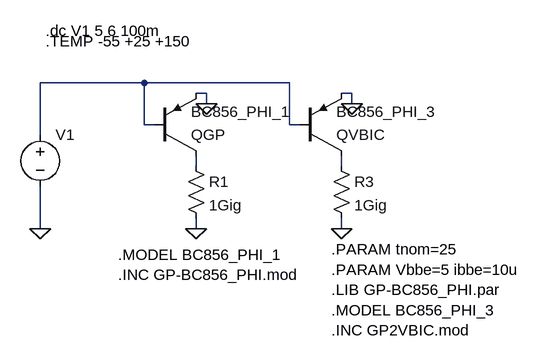
[diagram p0: schematic Level9Comparison.asc]
Level9Comparison.asc, the LTspice schematic file:
Version 4
SHEET 1 5756 2000
WIRE 1840 704 1680 704
WIRE 2064 704 1840 704
WIRE 1936 720 1920 720
WIRE 2160 720 2144 720
WIRE 1936 736 1936 720
WIRE 2160 736 2160 720
WIRE 1840 768 1840 704
WIRE 1856 768 1840 768
WIRE 2064 768 2064 704
WIRE 2080 768 2064 768
WIRE 1680 784 1680 704
WIRE 1920 832 1920 816
WIRE 2144 832 2144 816
WIRE 1680 928 1680 864
WIRE 1920 928 1920 912
WIRE 2144 928 2144 912
FLAG 1936 736 0
FLAG 1680 928 0
FLAG 1920 928 0
FLAG 2160 736 0
FLAG 2144 928 0
SYMBOL voltage 1680 768 R0
WINDOW 3 24 104 Invisible 0
WINDOW 123 0 0 Left 0
WINDOW 39 0 0 Left 0
SYMATTR Value 1
SYMATTR InstName V1
SYMBOL pnp 1856 816 M180
SYMATTR InstName QGP
SYMATTR Value BC856_PHI_1
SYMBOL res 1904 816 R0
SYMATTR InstName R1
SYMATTR Value 1Gig
SYMBOL pnp 2080 816 M180
SYMATTR InstName QVBIC
SYMATTR Value BC856_PHI_3
SYMBOL res 2128 816 R0
SYMATTR InstName R3
SYMATTR Value 1Gig
TEXT 1800 968 Left 0 !.MODEL BC856_PHI_1\n.INC GP-BC856_PHI.mod
TEXT 1688 624 Left 0 !.dc V1 5 6 100m
TEXT 1688 640 Left 0 !.TEMP -55 +25 +150
TEXT 2128 960 Left 0 !.PARAM tnom=25\n.PARAM Vbbe=5 ibbe=10u \n.LIB GP-BC856_PHI.par\n.MODEL BC856_PHI_3\n.INC GP2VBIC.mod

The netlist it stands for:
* Level9Comparison.asc
V1 N001 0 1
QGP N002 N001 0 0 BC856_PHI_1
R1 N002 0 1Gig
QVBIC N003 N001 0 0 BC856_PHI_3
R3 N003 0 1Gig
.model NPN NPN
.model PNP PNP
.lib standard.bjt
.MODEL BC856_PHI_1
.INC GP-BC856_PHI.mod
.dc V1 5 6 100m
.TEMP -55 +25 +150
.PARAM tnom=25
.PARAM Vbbe=5 ibbe=10u
.LIB GP-BC856_PHI.par
.MODEL BC856_PHI_3
.INC GP2VBIC.mod
.backanno
.end